# Altium project BASPI_Project.PrjPcb
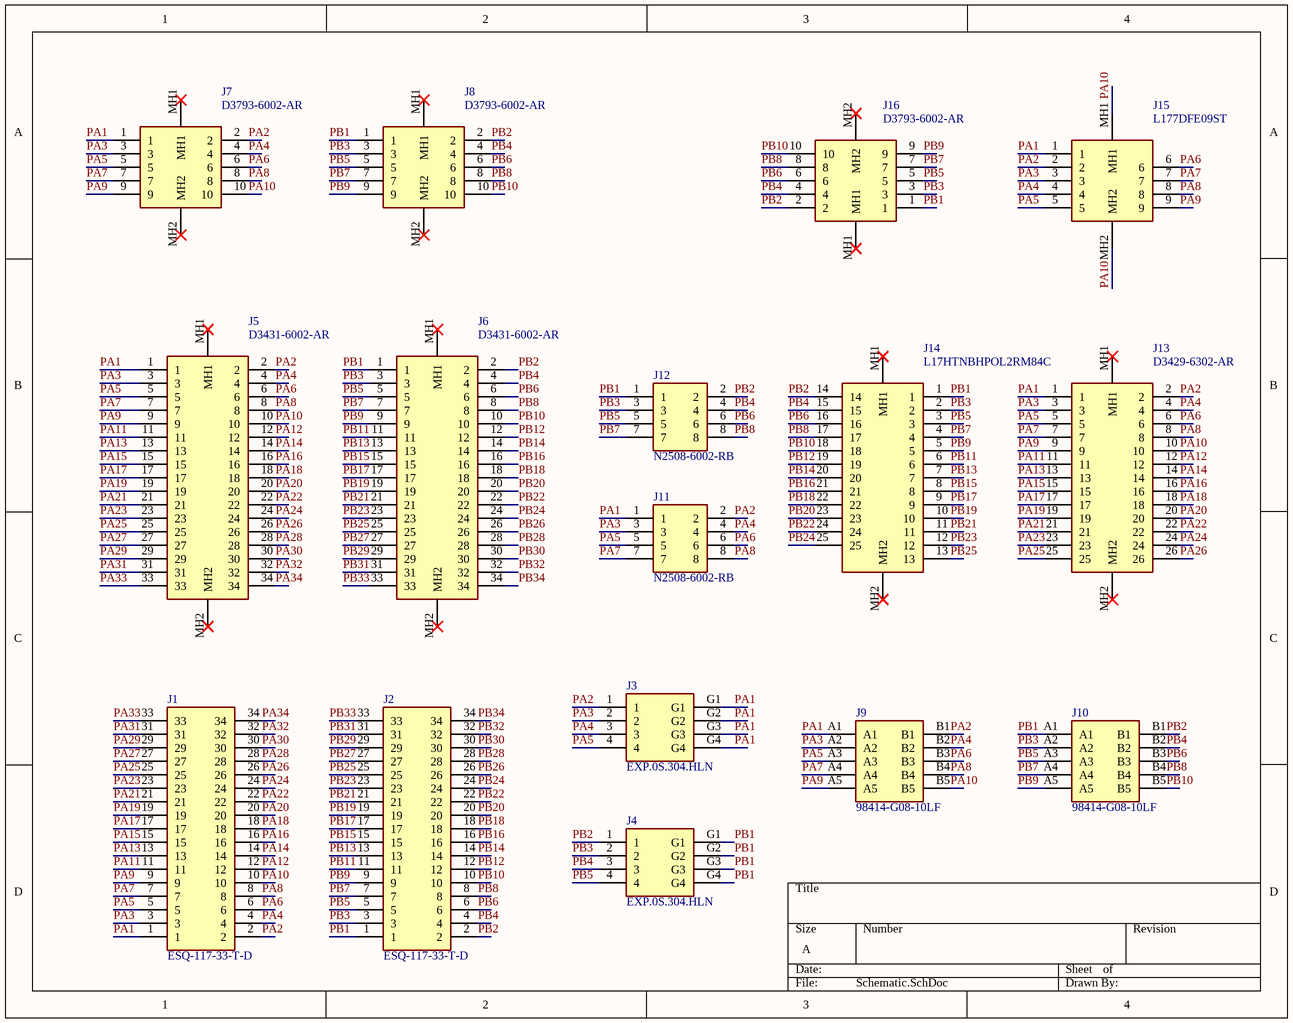
[diagram p0: Schematic.SchDoc]
1 sheet, 16 parts. Net scope: global (net labels, ports and power ports of the same name join across sheets).
Board file: PCB_Cable_Test_Adapter.PcbDoc

## Sheet Schematic.SchDoc: BASPI Cable Test Adapter
size A; Date: 04/07/2025; Author: Sammy GROS; CompanyName: BASPI; DrawnBy: Sammy GROS; SheetNumber: 1; SheetTotal: 1; Time: BASPI Cable Test Adapter

### Parts
J1  ESQ-117-33-T-D  [ESQ-117-Y-X-D]
J2  ESQ-117-33-T-D  [ESQ-117-Y-X-D]
J3  EXP.0S.304.HLN  [EXP0S304HLN]
J4  EXP.0S.304.HLN  [EXP0S304HLN]
J5  D3431-6002-AR  [D3431-6002-AR]
J6  D3431-6002-AR  [D3431-6002-AR]
J7  D3793-6002-AR  [D3793-6002-AR]
J8  D3793-6002-AR  [D3793-6002-AR]
J9  98414-G08-10LF  [98414G0810LF]
J10  98414-G08-10LF  [98414G0810LF]
J11  N2508-6002-RB  [SHDR8W64P254_2X4_1748X859X1004P]
J12  N2508-6002-RB  [SHDR8W64P254_2X4_1748X859X1004P]
J13  D3429-6302-AR  [D34296302AR]
J14  L17HTNBHPOL2RM84C  [L17HTNBHPOL2RM84C]
J15  L177DFE09ST  [L177DFE09ST]
J16  D3793-6002-AR  [D3793-6002-AR]

### Nets
PA1: J1.1 J3.G1 J3.G2 J3.G3 J3.G4 J5.1 J7.1 J9.A1 J11.1 J13.1 J15.1
PA2: J1.2 J3.1 J5.2 J7.2 J9.B1 J11.2 J13.2 J15.2
PA3: J1.3 J3.2 J5.3 J7.3 J9.A2 J11.3 J13.3 J15.3
PA4: J1.4 J3.3 J5.4 J7.4 J9.B2 J11.4 J13.4 J15.4
PA5: J1.5 J3.4 J5.5 J7.5 J9.A3 J11.5 J13.5 J15.5
PA6: J1.6 J5.6 J7.6 J9.B3 J11.6 J13.6 J15.6
PA7: J1.7 J5.7 J7.7 J9.A4 J11.7 J13.7 J15.7
PA8: J1.8 J5.8 J7.8 J9.B4 J11.8 J13.8 J15.8
PA9: J1.9 J5.9 J7.9 J9.A5 J13.9 J15.9
PA10: J1.10 J5.10 J7.10 J9.B5 J13.10 J15.MH1 J15.MH2
PA11: J1.11 J5.11 J13.11
PA12: J1.12 J5.12 J13.12
PA13: J1.13 J5.13 J13.13
PA14: J1.14 J5.14 J13.14
PA15: J1.15 J5.15 J13.15
PA16: J1.16 J5.16 J13.16
PA17: J1.17 J5.17 J13.17
PA18: J1.18 J5.18 J13.18
PA19: J1.19 J5.19 J13.19
PA20: J1.20 J5.20 J13.20
PA21: J1.21 J5.21 J13.21
PA22: J1.22 J5.22 J13.22
PA23: J1.23 J5.23 J13.23
PA24: J1.24 J5.24 J13.24
PA25: J1.25 J5.25 J13.25
PA26: J1.26 J5.26 J13.26
PA27: J1.27 J5.27
PA28: J1.28 J5.28
PA29: J1.29 J5.29
PA30: J1.30 J5.30
PA31: J1.31 J5.31
PA32: J1.32 J5.32
PA33: J1.33 J5.33
PA34: J1.34 J5.34
PB1: J2.1 J4.G1 J4.G2 J4.G3 J4.G4 J6.1 J8.1 J10.A1 J12.1 J14.1 J16.1
PB2: J2.2 J4.1 J6.2 J8.2 J10.B1 J12.2 J14.14 J16.2
PB3: J2.3 J4.2 J6.3 J8.3 J10.A2 J12.3 J14.2 J16.3
PB4: J2.4 J4.3 J6.4 J8.4 J10.B2 J12.4 J14.15 J16.4
PB5: J2.5 J4.4 J6.5 J8.5 J10.A3 J12.5 J14.3 J16.5
PB6: J2.6 J6.6 J8.6 J10.B3 J12.6 J14.16 J16.6
PB7: J2.7 J6.7 J8.7 J10.A4 J12.7 J14.4 J16.7
PB8: J2.8 J6.8 J8.8 J10.B4 J12.8 J14.17 J16.8
PB9: J2.9 J6.9 J8.9 J10.A5 J14.5 J16.9
PB10: J2.10 J6.10 J8.10 J10.B5 J14.18 J16.10
PB11: J2.11 J6.11 J14.6
PB12: J2.12 J6.12 J14.19
PB13: J2.13 J6.13 J14.7
PB14: J2.14 J6.14 J14.20
PB15: J2.15 J6.15 J14.8
PB16: J2.16 J6.16 J14.21
PB17: J2.17 J6.17 J14.9
PB18: J2.18 J6.18 J14.22
PB19: J2.19 J6.19 J14.10
PB20: J2.20 J6.20 J14.23
PB21: J2.21 J6.21 J14.11
PB22: J2.22 J6.22 J14.24
PB23: J2.23 J6.23 J14.12
PB24: J2.24 J6.24 J14.25
PB25: J2.25 J6.25 J14.13
PB26: J2.26 J6.26
PB27: J2.27 J6.27
PB28: J2.28 J6.28
PB29: J2.29 J6.29
PB30: J2.30 J6.30
PB31: J2.31 J6.31
PB32: J2.32 J6.32
PB33: J2.33 J6.33
PB34: J2.34 J6.34

Not connected (* = marked no-connect by the designer): J5 MH1* MH2*; J6 MH1* MH2*; J7 MH1* MH2*; J8 MH1* MH2*; J13 MH1* MH2*; J14 MH1* MH2*; J16 MH1* MH2*

### Library data of the parts
J1 J2 = ESQ-117-33-T-D: Connector; Manufacturer_Name: SAMTEC; Manufacturer_Part_Number: ESQ-117-44-T-D; Datasheet Link: http://suddendocs.samtec.com/prints/esq-1xx-xx-x-x-xxx-xx-x-xx-mkt.pdf; Mouser Part Number: 200-ESQ11744TD; Mouser Price/Stock: https://www.mouser.com/Search/Refine.aspx?Keyword=200-ESQ11744TD
J3 J4 = EXP.0S.304.HLN: Connector; Manufacturer_Name: LEMO; Datasheet Link: https://www.lemo.com/catalog/ROW/UK_English/unipole_multipole.pdf; Height: 12mm; Manufacturer_Part_Number: EXP.0S.304.HLN; Mouser Part Number: 736-EXP0S304HLN; Mouser Price/Stock: https://www.mouser.co.uk/ProductDetail/LEMO/EXP0S304HLN?qs=g4eXmMl0IezC49McAy%252Bbog%3D%3D
J5 J6 = D3431-6002-AR: Connector
J7 J8 J16 = D3793-6002-AR: Connector
J9 J10 = 98414-G08-10LF: Connector; Manufacturer_Name: Amphenol; Datasheet Link: https://cdn.amphenol-cs.com/media/wysiwyg/files/drawing/98414.pdf; Height: 6.2mm; Manufacturer_Part_Number: 98414-G08-10LF; Mouser Part Number: 649-98414-G08-10LF; Mouser Price/Stock: https://www.mouser.co.uk/ProductDetail/Amphenol-FCI/98414-G08-10LF?qs=dwWE9K4rTrPm8sS0qAKvPg%3D%3D
J11 J12 = N2508-6002-RB: Connector; Manufacturer_Name: 3M; Datasheet Link: https://multimedia.3m.com/mws/media/330367O/3m-four-wall-header-2500-series-ts-0770.pdf; Height: 10.04mm; Manufacturer_Part_Number: N2508-6002-RB; Mouser Part Number: 517-N2508-6002-RB; Mouser Price/Stock: https://www.mouser.com/Search/Refine.aspx?Keyword=517-N2508-6002-RB
J13 = D3429-6302-AR: Connector; Manufacturer_Name: 3M; Datasheet Link: http://multimedia.3m.com/mws/media/485761O/3mtm-four-wall-header-ts2245.pdf; Height: 13.7mm; Manufacturer_Part_Number: D3429-6302-AR; Mouser Part Number: 517-D3429-6302-AR; Mouser Price/Stock: https://www.mouser.co.uk/ProductDetail/3M-Electronic-Solutions-Division/D3429-6302-AR?qs=IDj0%2FmHVFfaTU4HTZsyChw%3D%3D
J14 = L17HTNBHPOL2RM84C: Connector; Manufacturer_Name: Amphenol Communications Solutions; Datasheet Link: https://cdn.amphenol-cs.com/media/wysiwyg/files/drawing/l17htnxhpol2rm8xc.pdf; Height: 12.5mm; Manufacturer_Part_Number: L17HTNBHPOL2RM84C; Mouser Part Number: 523-17HTNBHPOL2RM84C; Mouser Price/Stock: https://www.mouser.co.uk/ProductDetail/Amphenol-Commercial-Products/L17HTNBHPOL2RM84C?qs=ToP8pWlZ0bO6Ujv8%2FJibmw%3D%3D
J15 = L177DFE09ST: Connector; Manufacturer_Name: Amphenol; Datasheet Link: https://cdn.amphenol-cs.com/media/wysiwyg/files/drawing/l177dfxxxst.pdf; Height: 12.2mm; Manufacturer_Part_Number: L177DFE09ST